# EAGLE design LiDAR_Lite_Interface_HardSwitch (EAGLE 9.2.1)
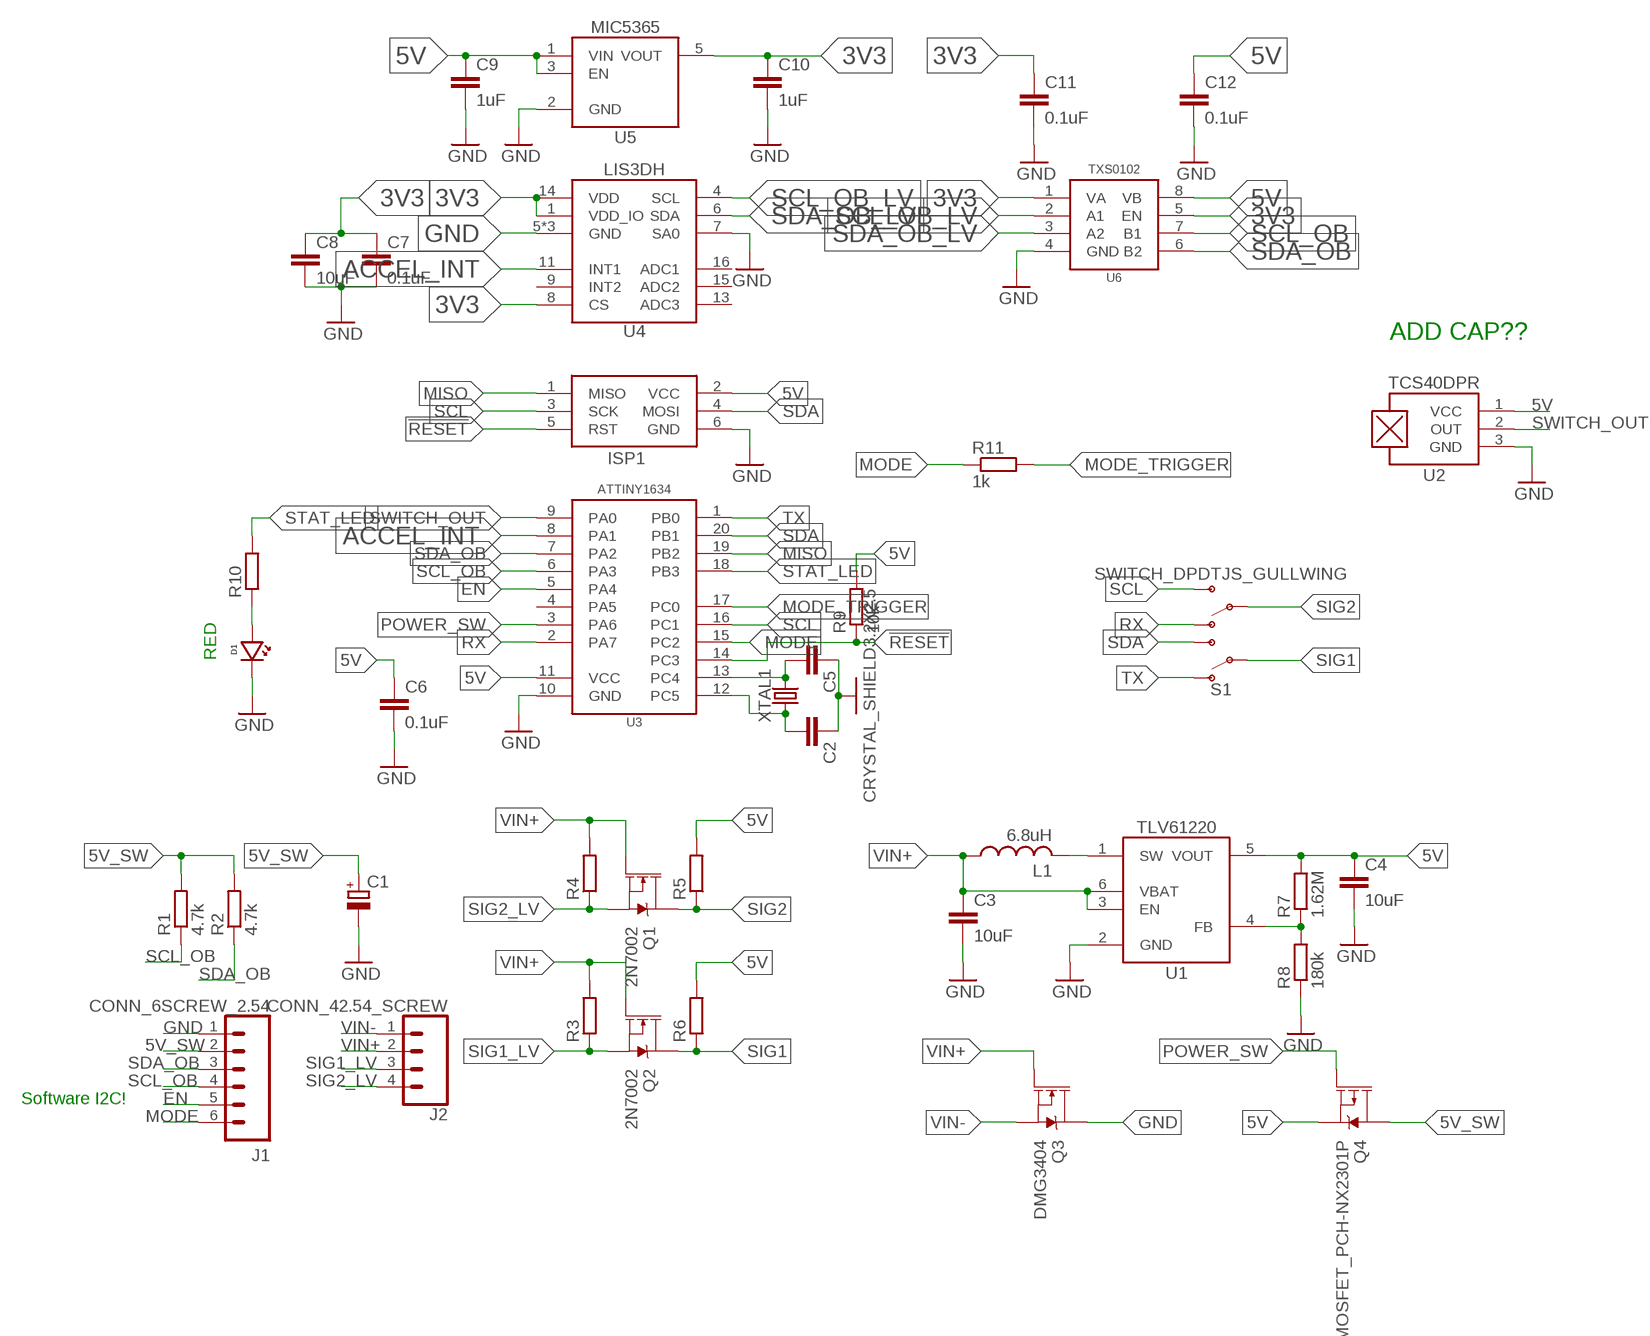
[diagram p0: schematic, sheet 1]

## Parts
C1  CPOL-EUUW-10X10  [UW-10X10_NICHICON]
C2  C-EU10PFC0603  [C0603]
C3  10uF  C-EU10UFC0805  [C0805]
C4  10uF  C-EU10UFC0805  [C0805]
C5  C-EU10PFC0603  [C0603]
C6  0.1uF  C-EU0.1UFC0603  [C0603]
C7  0.1uF  C-EU10UFC0805  [C0805]
C8  10uF  C-EU0.1UFC0603  [C0603]
C9  1uF  C-EU1UFC0603  [C0603]
C10  1uF  C-EU1UFC0603  [C0603]
C11  0.1uF  C-EU0.1UFC0402  [C0402]
C12  0.1uF  C-EU0.1UFC0402  [C0402]
D1  LED0603  [LED_0603]
ISP1  AVRISP-6  [AVRISP]
J1  CONN_6SCREW_2.54  [1X06_SCREW]
J2  CONN_42.54_SCREW  [1X04_SCREW]
L1  6.8uH  INDUCTOR1008  [1008]
Q1  2N7002  MOSFET-NCH-2N7002P  [SOT23-3]
Q2  2N7002  MOSFET-NCH-2N7002P  [SOT23-3]
Q3  DMG3404  MOSFET-NCH-DMG3404L  [SOT23-3]
Q4  MOSFET_PCH-NX2301P  [SOT23-3]
R1  4.7k  R-EU_4.7KR0603  [R0603]
R2  4.7k  R-EU_4.7KR0603  [R0603]
R3  R-EU_10KR0603  [R0603]
R4  R-EU_10KR0603  [R0603]
R5  R-EU_10KR0603  [R0603]
R6  R-EU_10KR0603  [R0603]
R7  1.62M  R-EU_1.62MR0603  [R0603]
R8  180k  R-EU_180KR0603  [R0603]
R9  10k  R-EU_10KR0603  [R0603]
R10  R-EU_330R0603  [R0603]
R11  1k  R-EU_1KR0603  [R0603]
S1  SWITCH_DPDTJS_GULLWING  [JS202011SCQN]
U1  TLV61220DBV  [DBV_R-PDSO-G6]
U2  TCS40DPRSOT23  [SOT23-3]
U3  ATTINY1634SOIC  [SO-20DW]
U4  LIS3DHLGA  [LGA-16]
U5  MIC53653.3SC70  [DCK_R-PDSO-G5]
U6  TXS0102DQM  [DQM_R-PX2SON-N8]
XTAL1  CRYSTAL_SHIELD3.2X2.5  [CRYSTAL_3.2X2.5_4-SMD]

## Nets
3V3: C7.1 C8.1 C10.1 C11.1 U4.1(VDD_IO) U4.8(CS) U4.14(VDD) U5.5(VOUT) U6.1(VA) U6.5(EN)
5V: C4.1 C6.1 C9.1 C12.1 ISP1.2(VCC) Q4.2(S) R5.2 R6.2 R7.2 R9.2 U1.5(VOUT) U2.1(VCC) U3.11(VCC) U5.1(VIN) U5.3(EN) U6.8(VB)
5V_SW: C1.+ J1.2 Q4.3(D) R1.2 R2.2
!RESET: ISP1.5(RST) R9.1 U3.14(PC3)
ACCEL_INT: U3.8(PA1) U4.11(INT1)
EN: J1.5 U3.5(PA4)
GND: C1.- C2.1 C3.2 C4.2 C5.1 C6.2 C7.2 C8.2 C9.2 C10.2 C11.2 C12.2 D1.CATHODE ISP1.6(GND) J1.1 Q3.3(D) R8.1 U1.2(GND) U2.3(GND) U3.10(GND) U4.5(GND) U4.7(SA0) U4.10(GND) U4.12(GND) U5.2(GND) U6.4(GND) XTAL1.2(GND) XTAL1.4(GND)
MISO: ISP1.1(MISO) U3.19(PB2)
MODE: J1.6 R11.1 U3.15(PC2)
MODE_TRIGGER: R11.2 U3.17(PC0)
N$1: C5.2 U3.13(PC4) XTAL1.3
N$3: C2.2 U3.12(PC5) XTAL1.1
N$4: D1.ANODE R10.1
N$7: R7.1 R8.2 U1.4(FB)
N$9: L1.2 U1.1(SW)
POWER_SW: Q4.1(G) U3.3(PA6)
RX: S1.6(O2) U3.2(PA7)
SCL: ISP1.3(SCK) S1.4(S2) U3.16(PC1)
SCL_OB: J1.4 R1.1 U3.6(PA3) U6.7(B1)
SCL_OB_LV: U4.4(SCL) U6.2(A1)
SDA: ISP1.4(MOSI) S1.3(S1) U3.20(PB1)
SDA_OB: J1.3 R2.1 U3.7(PA2) U6.6(B2)
SDA_OB_LV: U4.6(SDA) U6.3(A2)
SIG1: Q2.3(D) R6.1 S1.2(P1)
SIG1_LV: J2.3 Q2.2(S) R3.1
SIG2: Q1.3(D) R5.1 S1.5(P2)
SIG2_LV: J2.4 Q1.2(S) R4.1
STAT_LED: R10.2 U3.18(PB3)
SWITCH_OUT: U2.2(OUT) U3.9(PA0)
TX: S1.1(O1) U3.1(PB0)
VIN+: C3.1 J2.2 L1.1 Q1.1(G) Q2.1(G) Q3.1(G) R3.2 R4.2 U1.3(EN) U1.6(VBAT)
VIN-: J2.1 Q3.2(S)
Unconnected: U3.4(PA5) U4.9(INT2) U4.13(ADC3) U4.15(ADC2) U4.16(ADC1)

## Notes on the sheet
- ADD CAP??
- RED
- Software I2C!

## Library data of the parts
C1 = bschulz_passives:CPOL-EU: POLARIZED CAPACITOR, European symbol; DIGIKEY: 493-2182-1-ND; MF: Nichicon; MPN: UWT1C681MNL1GS
C2 C5 = bschulz_passives:C-EU: CAPACITOR, European symbol; DIGIKEY: 311-1058-1-ND; MF: Yageo; MPN: CC0603JRNPO9BN100CC0603JRNPO9BN100
C3 C4 C7 = bschulz_passives:C-EU: CAPACITOR, European symbol; DIGIKEY: 490-6473-6-ND; MF: Murata; MPN: GRM21BR61C106KE15K
C6 C8 = bschulz_passives:C-EU: CAPACITOR, European symbol; DIGIKEY: 490-6051-1-ND; MF: Murata; MPN: GCM188R71E104KA57D
C9 C10 = bschulz_passives:C-EU: CAPACITOR, European symbol; DIGIKEY: 490-10479-1-ND; MF: Murata; MPN: GRM188R61C105KA12D
C11 C12 = bschulz_passives:C-EU: CAPACITOR, European symbol; DIGIKEY: 490-4759-1-ND; MF: Murata; MPN: GCM155R71C104KA55D
D1 = bschulz:LED: Genaric LED; DIGIKEY: 732-4978-1-ND; MF: Wurth; MPN: 150060RS75000
ISP1 = bschulz:AVRISP: AVR ISP HEADER Standard 6 pin header for AVR programming
J1 = bschulz:CONN_6: Genaric 6 terminal header Digikey 2.54_SCREW <https://www.digikey.com/product-detail/en/on-shore-technology-inc/OSTVN06A150/ED10565-ND/1588866>; DIGIKEY: ED10565-ND; MF: OnShore; MPN: OSTVN06A150
J2 = bschulz:CONN_4: Genaric 4 terminal header Digikey 2.54_SCREW <https://www.digikey.com/product-detail/en/on-shore-technology-inc/OSTVN04A150/ED10563-ND/1588864>; DIGIKEY: ED10563-ND; MF: On Shore; MPN: OSTVN04A150
L1 = bschulz:INDUCTOR: Genaric inductor; DIGIKEY: 732-4849-1-ND; MF: Wurth; MPN: 74438323068
Q1 Q2 = bschulz:MOSFET-NCH: N-channel MOSFETs Voltage controlled devices that allow control of high current outputs. SparkFun Products: SparkFun OpenScale <https://www.sparkfun.com/products/13261> SparkFun Digital Sandbox <https://www.sparkfun.com/products/12651> SparkFun Monster Moto Shield <https://www.sparkfun.com/products/10182> SparkFun MOSFET Power Controller <https://www.sparkfun.com/products/11214>; DIGIKEY: 1727-4692-1-ND; MF: Nexperia; MPN: 2N7002P,215
Q3 = bschulz:MOSFET-NCH: N-channel MOSFETs Voltage controlled devices that allow control of high current outputs. SparkFun Products: SparkFun OpenScale <https://www.sparkfun.com/products/13261> SparkFun Digital Sandbox <https://www.sparkfun.com/products/12651> SparkFun Monster Moto Shield <https://www.sparkfun.com/products/10182> SparkFun MOSFET Power Controller <https://www.sparkfun.com/products/11214>; DIGIKEY: DMG3404L-7DICT-ND; MF: Diodes Incorporated; MPN: DMG3404L-7
Q4 = bschulz:MOSFET_PCH: P-channel MOSFETs Voltage controlled devices that allow control of high current outputs. SparkFun Products: SparkFun ESP32 Thing <https://www.sparkfun.com/products/13907> SparkFun ESP8266 Thing <https://www.sparkfun.com/products/13231>; DIGIKEY: 1727-1148-1-ND; MF: Nexperia; MPN: NX2301P,215
R1 R2 = bschulz_passives:R-EU_: RESISTOR, European symbol Digikey Parts: Yageo, 0402 <https://www.digikey.com/products/en/resistors/chip-resistor-surface-mount/52?k=&pkeyword=&sf=0&FV=ffec1104%2Cfffc000d%2C1c0002%2C440067%2C1f140000%2Cffe00034%2C400004&quantity=&ColumnSort=0&page=1&stock=1&pageSize=25> Yageo, 0603 <https://www.digikey.com/products/en/resistors/chip-resistor-surface-mount/52?k=&pkeyword=&s=4356&s=47360&sf=0&FV=fffc000d%2C1c0002%2C142c040c%2C1f140000%2Cffe00034&quantity=10&ColumnSort=1000011&page=1&stock=1&pageSize=25> Panasonic, 0603 <https://www.digikey.com/products/en/resistors/chip-resistor-surface-mount/52?k=&pkeyword=&pv252=68&sf=0&FV=ffec373d%2C1c0002%2C142c040c%2C1f140000%2Cffe00034%2C80002%2Cc0001&quantity=&ColumnSort=0&page=1&stock=1&pageSize=25> Panasonic, precision, 0603 <https://www.digikey.com/products/en/resistors/chip-resistor-surface-mount/52?FV=ffec4907%2Cfffc000a%2Cc0172%2C142c040c%2C1f140000%2Cffe00034%2C1c0002&quantity=100&ColumnSort=2085&page=1&stock=1&pageSize=25> Panasonic, 0805 <https://www.digikey.com/products/en/resistors/chip-resistor-surface-mount/52?k=&pkeyword=&pv3=1&sf=0&FV=ffec373d%2C1c0002%2C1f140000%2Cffe00034%2C142c040d&quantity=&ColumnSort=0&page=1&stock=1&pageSize=25> Rohm, current sense <https://www.digikey.com/products/en/resistors/chip-resistor-surface-mount/52?k=&pkeyword=&pv3=1&sf=0&FV=ffecb688%2C1f140000%2Cffe00034%2C1c0002&quantity=&ColumnSort=0&page=1&stock=1&pageSize=25> Vishay, pulse proof automotive <https://www.digikey.com/products/en/resistors/chip-resistor-surface-mount/52?k=&pkeyword=&pv7=2&sf=0&FV=ffec5d6b%2Cffe00034%2C1f140000&quantity=&ColumnSort=0&page=1&stock=1&pageSize=25>; DIGIKEY: 311-4.70KHRCT-ND; MF: Yageo; MPN: RC0603FR-074K7L; VALUE_PART: 4.7k
R3-R6 R9 = bschulz_passives:R-EU_: RESISTOR, European symbol Digikey Parts: Yageo, 0402 <https://www.digikey.com/products/en/resistors/chip-resistor-surface-mount/52?k=&pkeyword=&sf=0&FV=ffec1104%2Cfffc000d%2C1c0002%2C440067%2C1f140000%2Cffe00034%2C400004&quantity=&ColumnSort=0&page=1&stock=1&pageSize=25> Yageo, 0603 <https://www.digikey.com/products/en/resistors/chip-resistor-surface-mount/52?k=&pkeyword=&s=4356&s=47360&sf=0&FV=fffc000d%2C1c0002%2C142c040c%2C1f140000%2Cffe00034&quantity=10&ColumnSort=1000011&page=1&stock=1&pageSize=25> Panasonic, 0603 <https://www.digikey.com/products/en/resistors/chip-resistor-surface-mount/52?k=&pkeyword=&pv252=68&sf=0&FV=ffec373d%2C1c0002%2C142c040c%2C1f140000%2Cffe00034%2C80002%2Cc0001&quantity=&ColumnSort=0&page=1&stock=1&pageSize=25> Panasonic, precision, 0603 <https://www.digikey.com/products/en/resistors/chip-resistor-surface-mount/52?FV=ffec4907%2Cfffc000a%2Cc0172%2C142c040c%2C1f140000%2Cffe00034%2C1c0002&quantity=100&ColumnSort=2085&page=1&stock=1&pageSize=25> Panasonic, 0805 <https://www.digikey.com/products/en/resistors/chip-resistor-surface-mount/52?k=&pkeyword=&pv3=1&sf=0&FV=ffec373d%2C1c0002%2C1f140000%2Cffe00034%2C142c040d&quantity=&ColumnSort=0&page=1&stock=1&pageSize=25> Rohm, current sense <https://www.digikey.com/products/en/resistors/chip-resistor-surface-mount/52?k=&pkeyword=&pv3=1&sf=0&FV=ffecb688%2C1f140000%2Cffe00034%2C1c0002&quantity=&ColumnSort=0&page=1&stock=1&pageSize=25> Vishay, pulse proof automotive <https://www.digikey.com/products/en/resistors/chip-resistor-surface-mount/52?k=&pkeyword=&pv7=2&sf=0&FV=ffec5d6b%2Cffe00034%2C1f140000&quantity=&ColumnSort=0&page=1&stock=1&pageSize=25>; DIGIKEY: 311-10.0KHRCT-ND; MF: Yageo; MPN: RC0603FR-0710KL; VALUE_PART: 10k
R7 = bschulz_passives:R-EU_: RESISTOR, European symbol Digikey Parts: Yageo, 0402 <https://www.digikey.com/products/en/resistors/chip-resistor-surface-mount/52?k=&pkeyword=&sf=0&FV=ffec1104%2Cfffc000d%2C1c0002%2C440067%2C1f140000%2Cffe00034%2C400004&quantity=&ColumnSort=0&page=1&stock=1&pageSize=25> Yageo, 0603 <https://www.digikey.com/products/en/resistors/chip-resistor-surface-mount/52?k=&pkeyword=&s=4356&s=47360&sf=0&FV=fffc000d%2C1c0002%2C142c040c%2C1f140000%2Cffe00034&quantity=10&ColumnSort=1000011&page=1&stock=1&pageSize=25> Panasonic, 0603 <https://www.digikey.com/products/en/resistors/chip-resistor-surface-mount/52?k=&pkeyword=&pv252=68&sf=0&FV=ffec373d%2C1c0002%2C142c040c%2C1f140000%2Cffe00034%2C80002%2Cc0001&quantity=&ColumnSort=0&page=1&stock=1&pageSize=25> Panasonic, precision, 0603 <https://www.digikey.com/products/en/resistors/chip-resistor-surface-mount/52?FV=ffec4907%2Cfffc000a%2Cc0172%2C142c040c%2C1f140000%2Cffe00034%2C1c0002&quantity=100&ColumnSort=2085&page=1&stock=1&pageSize=25> Panasonic, 0805 <https://www.digikey.com/products/en/resistors/chip-resistor-surface-mount/52?k=&pkeyword=&pv3=1&sf=0&FV=ffec373d%2C1c0002%2C1f140000%2Cffe00034%2C142c040d&quantity=&ColumnSort=0&page=1&stock=1&pageSize=25> Rohm, current sense <https://www.digikey.com/products/en/resistors/chip-resistor-surface-mount/52?k=&pkeyword=&pv3=1&sf=0&FV=ffecb688%2C1f140000%2Cffe00034%2C1c0002&quantity=&ColumnSort=0&page=1&stock=1&pageSize=25> Vishay, pulse proof automotive <https://www.digikey.com/products/en/resistors/chip-resistor-surface-mount/52?k=&pkeyword=&pv7=2&sf=0&FV=ffec5d6b%2Cffe00034%2C1f140000&quantity=&ColumnSort=0&page=1&stock=1&pageSize=25>; DIGIKEY: RMCF0603FT1M62CT-ND; MF: Stackpole; MPN: RMCF0603FT1M62; VALUE_PART: 1.62M
R8 = bschulz_passives:R-EU_: RESISTOR, European symbol Digikey Parts: Yageo, 0402 <https://www.digikey.com/products/en/resistors/chip-resistor-surface-mount/52?k=&pkeyword=&sf=0&FV=ffec1104%2Cfffc000d%2C1c0002%2C440067%2C1f140000%2Cffe00034%2C400004&quantity=&ColumnSort=0&page=1&stock=1&pageSize=25> Yageo, 0603 <https://www.digikey.com/products/en/resistors/chip-resistor-surface-mount/52?k=&pkeyword=&s=4356&s=47360&sf=0&FV=fffc000d%2C1c0002%2C142c040c%2C1f140000%2Cffe00034&quantity=10&ColumnSort=1000011&page=1&stock=1&pageSize=25> Panasonic, 0603 <https://www.digikey.com/products/en/resistors/chip-resistor-surface-mount/52?k=&pkeyword=&pv252=68&sf=0&FV=ffec373d%2C1c0002%2C142c040c%2C1f140000%2Cffe00034%2C80002%2Cc0001&quantity=&ColumnSort=0&page=1&stock=1&pageSize=25> Panasonic, precision, 0603 <https://www.digikey.com/products/en/resistors/chip-resistor-surface-mount/52?FV=ffec4907%2Cfffc000a%2Cc0172%2C142c040c%2C1f140000%2Cffe00034%2C1c0002&quantity=100&ColumnSort=2085&page=1&stock=1&pageSize=25> Panasonic, 0805 <https://www.digikey.com/products/en/resistors/chip-resistor-surface-mount/52?k=&pkeyword=&pv3=1&sf=0&FV=ffec373d%2C1c0002%2C1f140000%2Cffe00034%2C142c040d&quantity=&ColumnSort=0&page=1&stock=1&pageSize=25> Rohm, current sense <https://www.digikey.com/products/en/resistors/chip-resistor-surface-mount/52?k=&pkeyword=&pv3=1&sf=0&FV=ffecb688%2C1f140000%2Cffe00034%2C1c0002&quantity=&ColumnSort=0&page=1&stock=1&pageSize=25> Vishay, pulse proof automotive <https://www.digikey.com/products/en/resistors/chip-resistor-surface-mount/52?k=&pkeyword=&pv7=2&sf=0&FV=ffec5d6b%2Cffe00034%2C1f140000&quantity=&ColumnSort=0&page=1&stock=1&pageSize=25>; DIGIKEY: P180KHCT-ND; MF: Panasonic; MPN: ERJ-3EKF1803V; VALUE_PART: 180k
R10 = bschulz_passives:R-EU_: RESISTOR, European symbol Digikey Parts: Yageo, 0402 <https://www.digikey.com/products/en/resistors/chip-resistor-surface-mount/52?k=&pkeyword=&sf=0&FV=ffec1104%2Cfffc000d%2C1c0002%2C440067%2C1f140000%2Cffe00034%2C400004&quantity=&ColumnSort=0&page=1&stock=1&pageSize=25> Yageo, 0603 <https://www.digikey.com/products/en/resistors/chip-resistor-surface-mount/52?k=&pkeyword=&s=4356&s=47360&sf=0&FV=fffc000d%2C1c0002%2C142c040c%2C1f140000%2Cffe00034&quantity=10&ColumnSort=1000011&page=1&stock=1&pageSize=25> Panasonic, 0603 <https://www.digikey.com/products/en/resistors/chip-resistor-surface-mount/52?k=&pkeyword=&pv252=68&sf=0&FV=ffec373d%2C1c0002%2C142c040c%2C1f140000%2Cffe00034%2C80002%2Cc0001&quantity=&ColumnSort=0&page=1&stock=1&pageSize=25> Panasonic, precision, 0603 <https://www.digikey.com/products/en/resistors/chip-resistor-surface-mount/52?FV=ffec4907%2Cfffc000a%2Cc0172%2C142c040c%2C1f140000%2Cffe00034%2C1c0002&quantity=100&ColumnSort=2085&page=1&stock=1&pageSize=25> Panasonic, 0805 <https://www.digikey.com/products/en/resistors/chip-resistor-surface-mount/52?k=&pkeyword=&pv3=1&sf=0&FV=ffec373d%2C1c0002%2C1f140000%2Cffe00034%2C142c040d&quantity=&ColumnSort=0&page=1&stock=1&pageSize=25> Rohm, current sense <https://www.digikey.com/products/en/resistors/chip-resistor-surface-mount/52?k=&pkeyword=&pv3=1&sf=0&FV=ffecb688%2C1f140000%2Cffe00034%2C1c0002&quantity=&ColumnSort=0&page=1&stock=1&pageSize=25> Vishay, pulse proof automotive <https://www.digikey.com/products/en/resistors/chip-resistor-surface-mount/52?k=&pkeyword=&pv7=2&sf=0&FV=ffec5d6b%2Cffe00034%2C1f140000&quantity=&ColumnSort=0&page=1&stock=1&pageSize=25>; DIGIKEY: 311-330HRCT-ND; MF: Yageo; MPN: RC0603FR-07330RL; VALUE_PART: 330
R11 = bschulz_passives:R-EU_: RESISTOR, European symbol Digikey Parts: Yageo, 0402 <https://www.digikey.com/products/en/resistors/chip-resistor-surface-mount/52?k=&pkeyword=&sf=0&FV=ffec1104%2Cfffc000d%2C1c0002%2C440067%2C1f140000%2Cffe00034%2C400004&quantity=&ColumnSort=0&page=1&stock=1&pageSize=25> Yageo, 0603 <https://www.digikey.com/products/en/resistors/chip-resistor-surface-mount/52?k=&pkeyword=&s=4356&s=47360&sf=0&FV=fffc000d%2C1c0002%2C142c040c%2C1f140000%2Cffe00034&quantity=10&ColumnSort=1000011&page=1&stock=1&pageSize=25> Panasonic, 0603 <https://www.digikey.com/products/en/resistors/chip-resistor-surface-mount/52?k=&pkeyword=&pv252=68&sf=0&FV=ffec373d%2C1c0002%2C142c040c%2C1f140000%2Cffe00034%2C80002%2Cc0001&quantity=&ColumnSort=0&page=1&stock=1&pageSize=25> Panasonic, precision, 0603 <https://www.digikey.com/products/en/resistors/chip-resistor-surface-mount/52?FV=ffec4907%2Cfffc000a%2Cc0172%2C142c040c%2C1f140000%2Cffe00034%2C1c0002&quantity=100&ColumnSort=2085&page=1&stock=1&pageSize=25> Panasonic, 0805 <https://www.digikey.com/products/en/resistors/chip-resistor-surface-mount/52?k=&pkeyword=&pv3=1&sf=0&FV=ffec373d%2C1c0002%2C1f140000%2Cffe00034%2C142c040d&quantity=&ColumnSort=0&page=1&stock=1&pageSize=25> Rohm, current sense <https://www.digikey.com/products/en/resistors/chip-resistor-surface-mount/52?k=&pkeyword=&pv3=1&sf=0&FV=ffecb688%2C1f140000%2Cffe00034%2C1c0002&quantity=&ColumnSort=0&page=1&stock=1&pageSize=25> Vishay, pulse proof automotive <https://www.digikey.com/products/en/resistors/chip-resistor-surface-mount/52?k=&pkeyword=&pv7=2&sf=0&FV=ffec5d6b%2Cffe00034%2C1f140000&quantity=&ColumnSort=0&page=1&stock=1&pageSize=25>; DIGIKEY: 311-1KLDCT-ND; MF: Yageo; MPN: AC0603FR-071KL; VALUE_PART: 1k
S1 = bschulz:SWITCH_DPDT: Genric DPDT Switch; DIGIKEY: 401-2002-1-ND; MF: C&K; MPN: JS202011SCQN
U1 = bschulz:TLV61220: TLV61220 - Low-Input Voltage Step-Up Converter (Boost) Characteristics: Vin: 0.7V ~ 5.5V Vout: 1.8V ~ 5.5V Output Current (Max): 400 mA IQ: 5μA Operating Temperature: -40°C to 85°C Digikey: 296-30547-1-ND <https://www.digikey.com/product-detail/en/texas-instruments/TLV61220DBVR/296-30547-1-ND/3458120>; DIGIKEY: 296-30547-1-ND; MF: TI; MPN: TLV61220DBVR
U2 = bschulz:TCS40DPR: Hall Effect Sensor (TCS40DPR) Characteristics: Vcc: 2.3 ~ 5.5V ISupply: 12.8μA (Avg) IDrive: 1mA (10mA Max) Trip Point: 4.4mT (Max) Release Point: 0.4mT (Min) Hysterisis: 1.4mT Temp: -40°C ~ 85°C Digikey: TCS40DPRLFCT-ND <https://www.digikey.com/product-detail/en/toshiba-semiconductor-and-storage/TCS40DPRLF/TCS40DPRLFCT-ND/5012766>; DIGIKEY: TCS40DPRLFCT-ND; DISP: TCS40DPR; MF: Toshiba; MPN: TCS40DPR,LF
U3 = bschulz:ATTINY1634: ATtiny1634 8 bit AVR Microcontroller Features: Vcc: 1.8 ~ 5.5V Clock: Up to 16MHz, Internal 8MHz FRC, 32kHz RC Flash Memory: 16K SRAM: 1K EEPROM: 256B ADC: 10b, 12 port USART: Yes, x2 SPI: Yes I2C: Yes, slave only Notes: 2 analog comp. Digikey: ATTINY1634R-MURCT-ND (QFN) <https://www.digikey.com/product-detail/en/microchip-technology/ATTINY1634R-MUR/ATTINY1634R-MURCT-ND/3440781> ATTINY1634R-SU-ND (SOIC) <https://www.digikey.com/product-detail/en/ATTINY1634R-SU/ATTINY1634R-SU-ND/3128699/?itemSeq=272981030>; DIGIKEY: ATTINY1634-SURCT-ND; MF: Atmel; MPN: ATTINY1634-SUR
U4 = bschulz:LIS3DH: LIS3DH - Ultra-low-power High-performance 3-axis Digital Accelerometer (I2C/SPI) Characteristics: Vcc: 1.71V ~ 3.6V Acceleration Range: ±2g, ±4g, ±8g, ±16g Sensitivity: 1000 ~ 83 LSB/g (±2g ~ ± 16g) Bandwidth: 0.5Hz ~ 625kHz Operating Temperature: -40°C to 85°C Digikey: 497-10613-1-ND <https://www.digikey.com/product-detail/en/stmicroelectronics/LIS3DHTR/497-10613-1-ND/2334355>; DIGIKEY: 497-10613-1-ND; MF: ST; MPN: LIS3DHTR
U5 = bschulz:MIC5365: MIC5365-* - Low Power, High Performance, Linear Regulator Characteristics: Vin: 2.5V ~ 5.5V Vout: Many options, (1v ~ 3.3v) see datasheet <http://ww1.microchip.com/downloads/en/DeviceDoc/mic5365.pdf> IQ: 29μA typ Dropout Voltage: 55mV @ 50mA, input ≥ 2.8v Voltage Accuracy: 2% typ Output Current: 150 mA Operating Temperature: -40°C to 125°C Mouser: MIC5365-3.3YC5 (3.3V Fixed) <https://www.digikey.com/product-detail/en/microchip-technology/MIC5365-3.3YC5-TR/576-3193-1-ND/1868230> MIC5365-1.8YC5 (1.8V Fixed) <https://www.digikey.com/products/en/integrated-circuits-ics/pmic-voltage-regulators-linear/699?k=mic5365&k=&pkeyword=mic5365&sv=0&pv1291=881&sf=0&FV=1c0002%2C1f140000%2Cffe002bb%2C1bcc0020&quantity=&ColumnSort=0&page=1&stock=1&pageSize=25>; DIGIKEY: 576-3193-1-ND; MF: Microchip; MPN: MIC5365-3.3YC5-TR
U6 = bschulz:TXS0102: TXS0102 - 2 Channel Bidirectional Voltage Level Translator Characteristics: Vcc: 1.65 ~ 3.6V (Port A), 2.3 ~ 5.5V (Port B) IQ: 14.4μA Output Current: 50mA Output Type: Open Drain/Push-Pull Operating Temperature: -40°C to 85°C Digikey: 296-28368-1-ND (DQE) <https://www.digikey.com/product-detail/en/texas-instruments/TXS0102DQER/296-28368-1-ND/2625893> 296-28435-1-ND (DQM) <https://www.digikey.com/product-detail/en/texas-instruments/TXS0102DQMR/296-28435-1-ND/2638910> 296-21931-1-ND (DCU) <https://www.digikey.com/product-detail/en/texas-instruments/TXS0102DCUR/296-21931-1-ND/1629284>; DIGIKEY: 296-28435-1-ND; MF: TI; MPN: TXS0102DQMR
XTAL1 = bschulz:CRYSTAL_SHIELD: Crystal Oscilator w/Shield 4 Pin quartz crystal oscilators Variants 3.2x2.5mm (16MHz ~ 38.4 MHz) <https://www.digikey.com/products/en/crystals-oscillators-resonators/crystals/171?k=&pkeyword=&sv=0&pv7=2&sf=0&FV=ffe000ab%2Cffec1fd3&quantity=&ColumnSort=0&page=1&stock=1&pageSize=25>; DIGIKEY: 535-10901-1-ND; MF: Abricon; MPN: ABM8G-12.000MHZ-4Y-T3

## Board
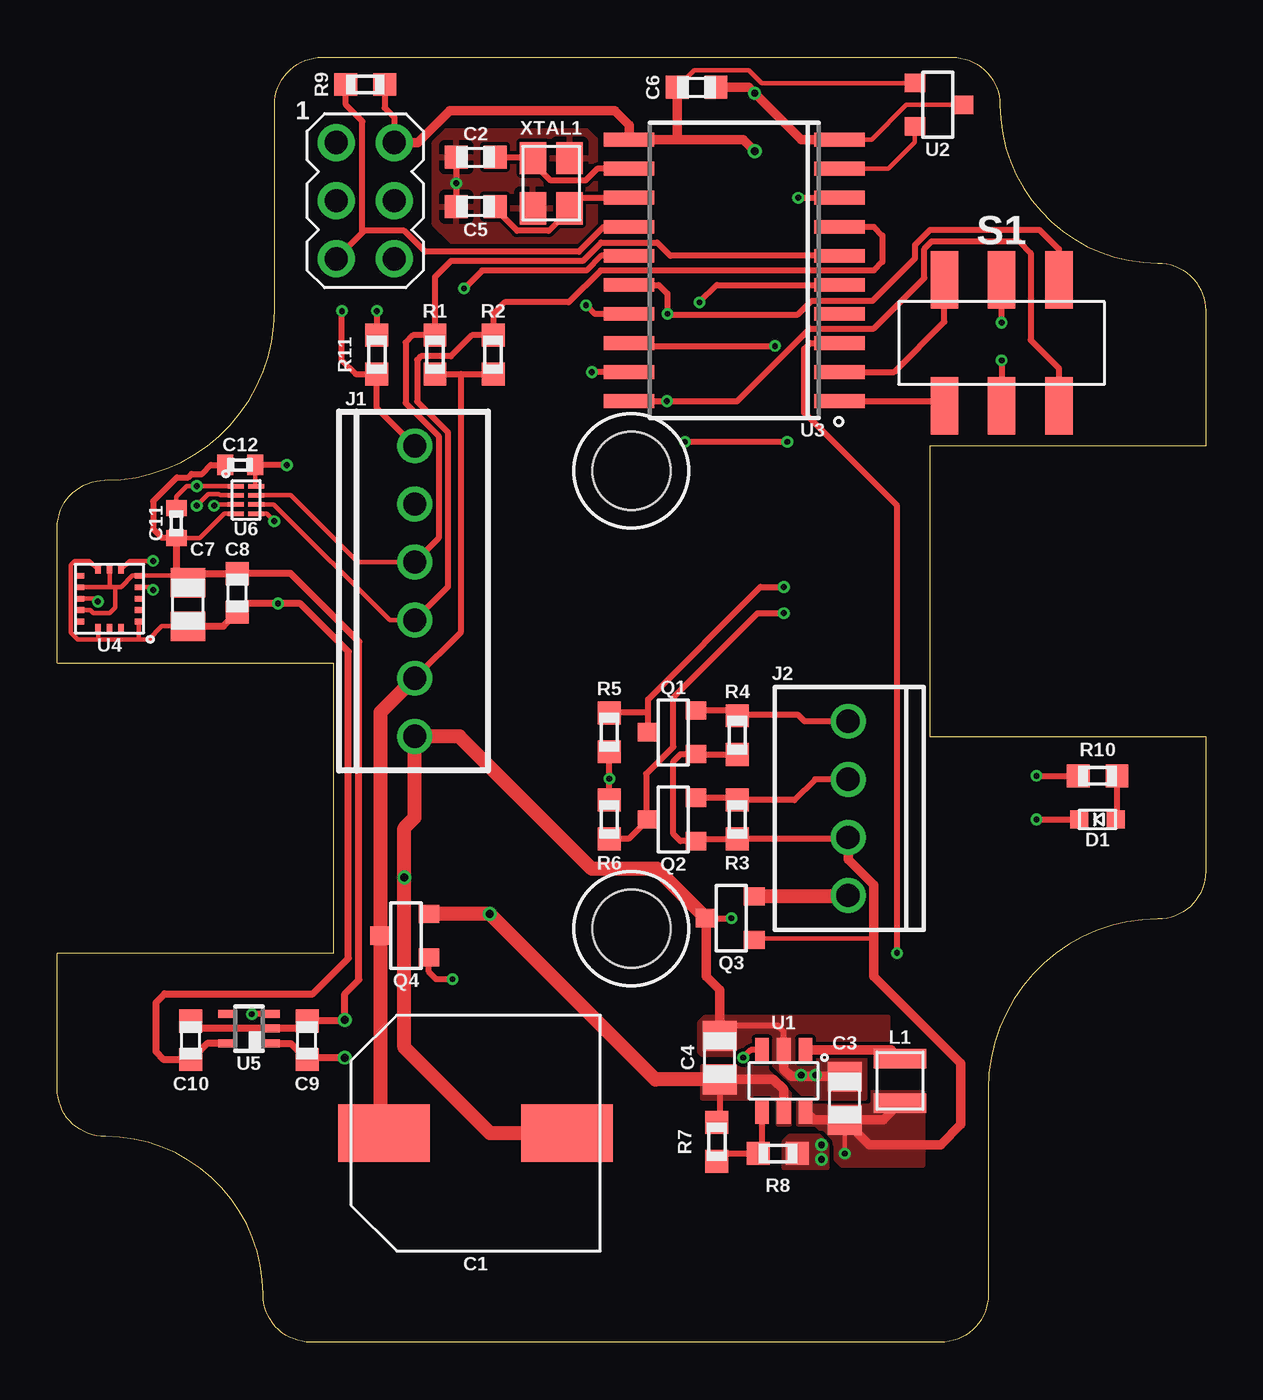
[diagram p1: board, top side]
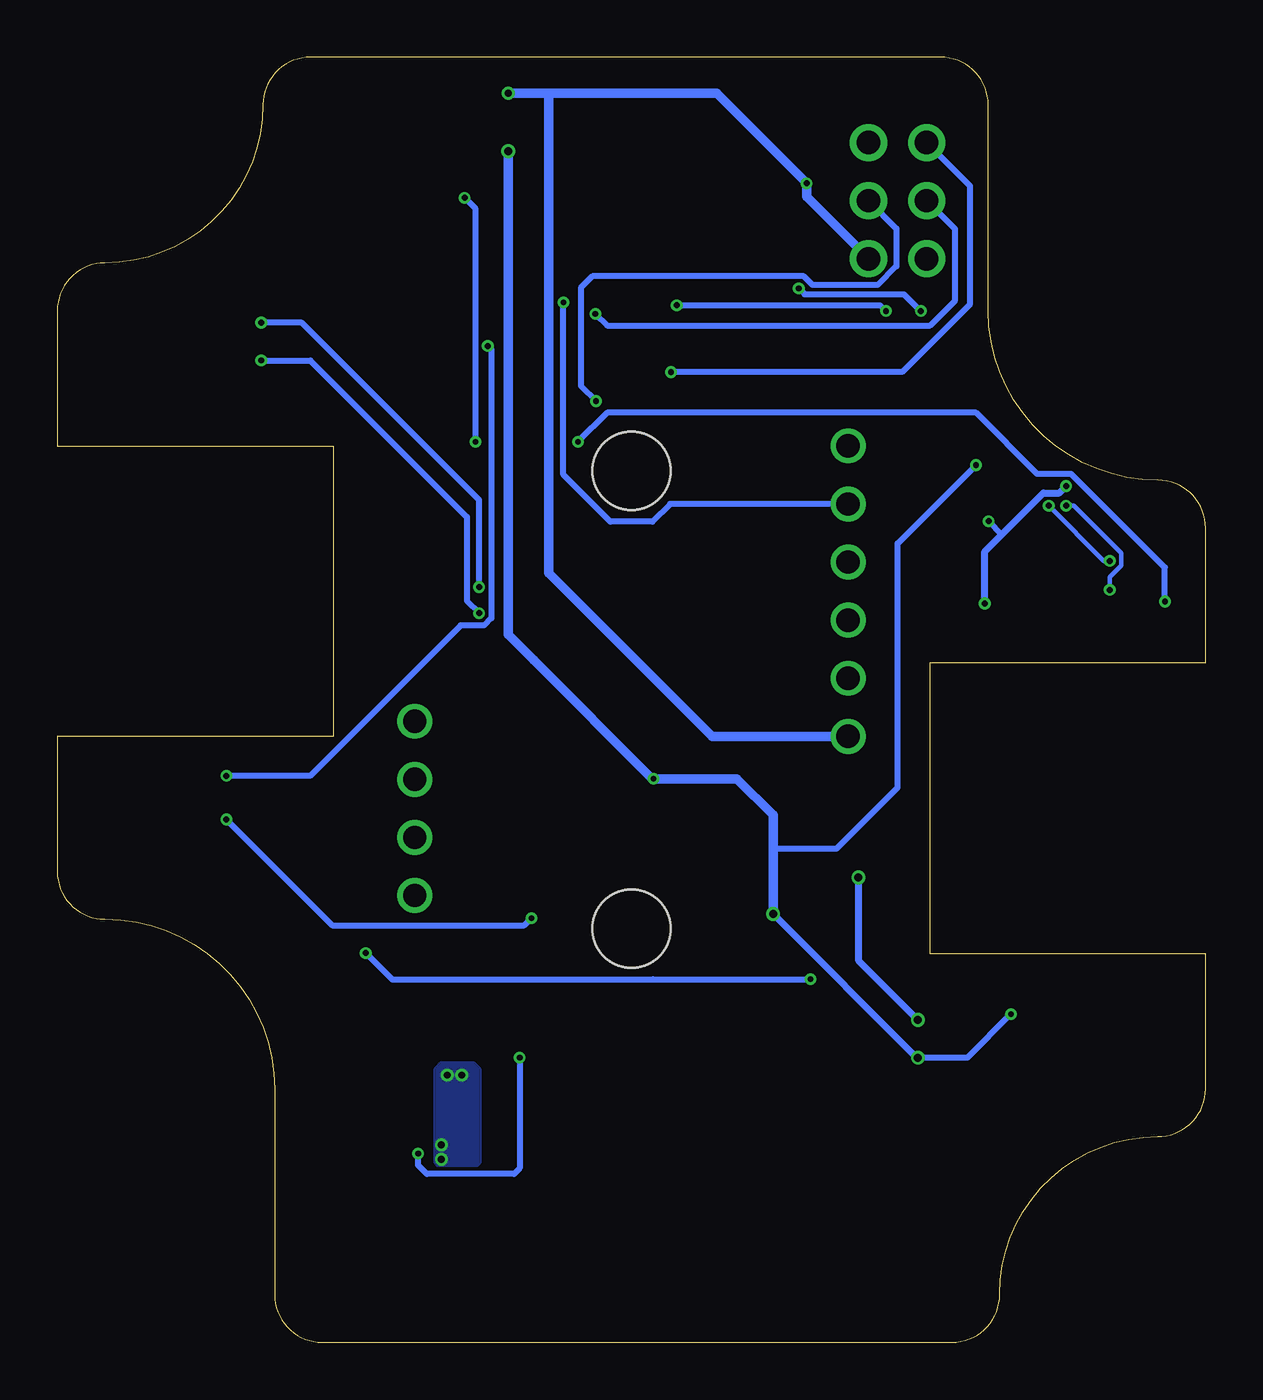
[diagram p2: board, bottom side, seen from below]

Size 50.19 x 56.18 mm. Coordinates in mm from the lower left corner, seen from the top.
Outline: 38.61,0 11.08,0 arc-90 9,2.1 arc90 2.1,9 arc-90 0,11.08 0,16.99 12.06,16.99 12.06,29.69 0,29.69 0,35.61 arc-90 2.08,37.69 arc90 9.5,45.11 9.5,54.1 arc-90 11.58,56.19 39.12,56.19 arc-90 41.2,54.1 arc90 48.11,47.19 arc-90 50.19,45.1 50.19,39.19 38.12,39.19 38.12,26.49 50.19,26.49 50.19,20.58 arc-90 48.11,18.5 arc90 40.69,11.08 40.69,2.08 arc-90 38.61,0
Copper layers (1*16): Top 0.035559375mm / dielectric 1.6mm / Bottom 0.035559375mm
Design rules "oshpark-2layer": minimum track width 6mil, minimum drill 10mil, track to track 6mil, track to pad 6mil, pad to pad 6mil, via to via 6mil, smd to smd 6mil, copper to edge 15mil, drill to drill 6mil, minimum pad ring 5mil, minimum via ring 5mil, stop-mask expansion 2.5mil, vias tented up to drill 0mil, thermal gap 10mil
Holes 3.43 mm at 25.1,18.08 25.1,38.1

### Footprints (pad centres in the part's own frame; a part is rotated, then mirrored left to right if it is on the bottom)
UW-10X10_NICHICON = smd 2.5 x 4: + 0,4; - 0,-4
C0603 = smd 1 x 1: 1 -0.85,0; 2 0.85,0
C0805 = smd 1.3 x 1.5: 1 -0.95,0; 2 0.95,0
C0402 = smd 0.7 x 0.9: 1 -0.65,0; 2 0.65,0
LED_0603 = smd 0.8 x 0.8: ANODE 0.8,0; CATHODE -0.8,0
AVRISP = drill 1.02 pad 1.626: 1 -1.27,2.54; 2 1.27,2.54; 3 -1.27,0; 4 1.27,0; 5 -1.27,-2.54; 6 1.27,-2.54
1X06_SCREW = drill 1.016: 1 -6.35,0; 2 -3.81,0; 3 -1.27,0; 4 1.27,0; 5 3.81,0; 6 6.35,0
1X04_SCREW = drill 1.016: 1 -3.81,0; 2 -1.27,0; 3 1.27,0; 4 3.81,0
1008 = smd 0.85 x 2.3: 1 -0.975,0; 2 0.975,0
SOT23-3 = smd 0.8 x 0.9: 1 -0.95,-1; 2 0.95,-1; 3 0,1.1
R0603 = smd 1 x 1: 1 -0.85,0; 2 0.85,0
JS202011SCQN = smd 1.2 x 2.515: 1 -2.5,-2.75; 2 0,-2.75; 3 2.5,-2.75; 4 2.5,2.75; 5 0,2.75; 6 -2.5,2.75
DBV_R-PDSO-G6 = smd 0.6 x 1.05: 1 -0.95,-1.35; 2 0,-1.35; 3 0.95,-1.35; 4 0.95,1.35; 5 0,1.35; 6 -0.95,1.35
SO-20DW = smd 0.6 x 2.2: 1 -5.715,-4.6; 2 -4.445,-4.6; 3 -3.175,-4.6; 4 -1.905,-4.6; 5 -0.635,-4.6; 6 0.635,-4.6; 7 1.905,-4.6; 8 3.175,-4.6; 9 4.445,-4.6; 10 5.715,-4.6; 11 5.715,4.6; 12 4.445,4.6; 13 3.175,4.6; 14 1.905,4.6; 15 0.635,4.6; 16 -0.635,4.6; 17 -1.905,4.6; 18 -3.175,4.6; 19 -4.445,4.6; 20 -5.715,4.6
LGA-16 = smd 0.35 x 0.25: 1 -1.275,1; 2 -1.275,0.5; 3 -1.275,0; 4 -1.275,-0.5; 5 -1.275,-1; 9 1.275,-1; 10 1.275,-0.5; 11 1.275,0; 12 1.275,0.5; 13 1.275,1 | smd 0.25 x 0.35: 6 -0.5,-1.275; 7 0,-1.275; 8 0.5,-1.275; 14 0.5,1.275; 15 0,1.275; 16 -0.5,1.275
DCK_R-PDSO-G5 = smd 0.35 x 0.8: 1 -0.65,-0.95; 2 0,-0.95; 3 0.65,-0.95; 4 0.65,0.95; 5 -0.65,0.95
DQM_R-PX2SON-N8 = smd 0.2 x 0.7: 1 -0.6,-0.45; 2 -0.2,-0.45; 3 0.2,-0.45; 4 0.6,-0.45; 5 0.6,0.45; 6 0.2,0.45; 7 -0.2,0.45; 8 -0.6,0.45
CRYSTAL_3.2X2.5_4-SMD = smd 1.4 x 1.15: 1 -1.1,-0.8; 2 1.1,-0.8; 3 1.1,0.8; 4 -1.1,0.8

### Placement (x,y rotation side)
C1  680uF  [UW-10X10_NICHICON]  18.29,9.14 90 top
C2  10pF  [C0603]  18.29,51.82 0 top
C3  34.42,10.67 90 top
C4  28.96,12.45 90 top
C5  10pF  [C0603]  18.29,49.66 0 top
C6  27.94,54.86 0 top
C7  10uF  [C0805]  5.71,32.26 90 top
C8  0.1uF  [C0603]  7.87,32.77 90 top
C9  10.92,13.21 90 top
C10  5.84,13.21 90 top
C11  5.21,35.81 270 top
C12  8,38.35 180 top
D1  45.47,22.86 0 top
ISP1  13.46,49.91 0 top
J1  15.62,32.84 90 top
J2  34.56,23.34 90 top
L1  36.83,11.43 90 top
Q1  26.92,26.67 90 top
Q2  26.92,22.86 90 top
Q3  29.46,18.54 90 top
Q4  15.24,17.78 90 top
R1  16.51,43.18 270 top
R2  19.05,43.18 270 top
R3  10k  [R0603]  29.72,22.86 270 top
R4  10k  [R0603]  29.72,26.54 270 top
R5  10k  [R0603]  24.13,26.67 270 top
R6  10k  [R0603]  24.13,22.86 90 top
R7  28.83,8.76 90 top
R8  31.5,8.26 180 top
R9  13.46,54.99 0 top
R10  330  [R0603]  45.47,24.77 180 top
R11  13.97,43.18 90 top
S1  41.27,43.69 0 top
U1  31.75,11.43 180 top
U2  38.48,54.1 270 top
U3  29.59,46.86 90 top
U4  2.29,32.51 180 top
U5  8.38,13.72 90 top
U6  8.26,36.83 270 top
XTAL1  21.59,50.67 270 top

### Tracks (layer width: path | path; a pad name or v marks a point on that pad's centre or on a via)
3V3  (via drill 0.25)
  Top 0.2: 1.78,30.73 0.89,30.73 0.58,31.04 0.58,33.98 0.76,34.16 1.41,34.16 U4.8 | U4.14 1.79,30.74 1.78,30.73 | 5.51,31.51 C7.1 4.57,31.31 4,30.73 3.56,30.73 | U6.1 7.22,37.43 7.21,37.44 v6.1,37.44 5.67,37.44 5.21,36.97 C11.1 | U6.5 9.15,36.23 v9.48,35.9 | 3.56,30.73 1.78,30.73 | U4.1 3.56,30.74 3.56,30.73
  Top 0.305: U5.5 6.55,13.07 C10.1 4.66,12.36 4.32,12.7 4.32,14.86 4.7,15.24 11.18,15.24 12.72,16.79 12.72,30.2 10.63,32.3 v9.65,32.3 8.26,32.3 C8.1 7.27,31.31 C7.1
  Bottom 0.254: v9.48,35.9 8.9,35.32
  Bottom 0.305: v6.1,37.44 6.4,37.13 7.09,37.13 8.9,35.32 9.65,34.57 v9.65,32.3
5V  (via drill 0.25, 0.35)
  Top 0.2: U2.1 30.79,55.05 30.22,55.62 27.84,55.62 C6.1 | C12.1 8.65,37.48 U6.8
  Top 0.254: C4.1 28.96,9.74 R7.2 | R5.2 v24.13,24.64 R6.2 | R9.2 14.31,53.98 14.73,53.55 ISP1.2 | v10.03,38.35 C12.1 | U5.3 8.52,14.37 v8.51,14.35
  Top 0.305: v12.57,12.45 11.01,12.45 C9.1 10.21,13.07 U5.1
  Top 0.406: C4.1 31.3,11.5 31.75,11.05 U1.5 | v30.48,52.07 29.97,52.58 27.05,52.58 | 27.05,52.58 U3.11 24.99,53.21 24.36,53.85 17.14,53.85 15.75,52.45 ISP1.2 | C6.1 27.09,52.62 27.05,52.58
  Top 0.61: C4.1 26.14,11.5 v18.91,18.73 Q4.2
  Bottom 0.254: 29.34,29.84 29.36,29.82 | 18.91,21.59 16.13,21.59 13.46,24.26 13.46,34.92 v10.03,38.35 | v8.51,14.35 10.41,12.45 v12.57,12.45
  Bottom 0.305: v18.91,18.73 12.62,12.45 v12.57,12.45
  Bottom 0.406: v18.91,18.73 18.91,21.59 18.91,23.05 20.5,24.64 v24.13,24.64 24.18,24.64 29.36,29.82 30.48,30.94 v30.48,52.07
  pour Top (rank 2, no thermals): 32,9.53 32,11.3 31.24,12.06 28.19,12.06 28.19,10.67 31.37,10.67 31.5,10.54 31.5,9.53
5V_SW
  Top 0.254: R1.2 17.65,42.33 | 17.65,42.33 R2.2 | J1.2 17.65,31.06 17.65,42.33
  Top 0.61: C1.+ 14.14,9.29 Q4.3 14.14,27.55 J1.2
!RESET
  Top 0.254: U3.14 23.89,48.77 22.8,47.68 16.08,47.68 15.16,48.59 13.41,48.59 13.34,48.51 | ISP1.5 13.34,48.51 | R9.1 12.61,54.1 13.34,53.38 13.34,48.51
ACCEL_INT  (via drill 0.25)
  Top 0.2: U4.11 1.65,32.51 v1.78,32.38
  Top 0.254: v27.43,39.37 v31.91,39.37 | v32.38,50.04 U3.8
  Bottom 0.254: v1.78,32.38 v1.78,32.39 1.78,33.87 5.88,37.97 7.36,37.97 10.03,40.64 26.16,40.64 v27.43,39.37 | v31.91,39.37 31.91,49.56 v32.38,50.04
EN  (via drill 0.25)
  Top 0.254: v28.07,45.47 28.83,46.23 U3.5
  Bottom 0.254: J1.5 23.4,36.65 24.18,35.88 26.02,35.88 28.07,37.93 v28.07,45.47
GND  (via drill 0.25, 0.3, 0.35)
  Top 0.2: U2.3 37.11,54.1 35.59,52.58 U3.10 | C7.2 5.41,33.51 U4.5 3.29,33.51 2.79,33.02 2.54,33.02 | U4.7 2.29,33.02 | U4.10 2.29,33.02 | 2.54,33.02 2.29,33.02 | 2.54,33.02 2.54,32.13 2.29,31.88 2.28,31.88 1.57,31.88 1.44,32.01 U4.12 | U6.4 7.3,36.23 6.23,35.16 C11.2
  Top 0.254: U1.2 31.75,13.59 31.5,13.84 29.4,13.84 C4.2 | C5.1 v17.44,50.67 C2.1 | C11.2 4.59,35.16 4.19,35.56 4.19,36.77 5.24,37.81 5.72,37.81 5.88,37.97 6.33,37.97 6.72,38.35 C12.2 | Q3.3 v29.46,18.54 | v42.8,22.86 D1.CATHODE
  Top 0.305: C10.2 6.18,13.72 U5.2 10.58,13.72 C9.2 12.53,14.06 v12.57,14.1 12.57,15.24 13.18,15.85 13.18,30.63 10.2,33.62 C8.2 6.12,33.62 C7.2 5.21,33.72 C11.2
  Top 0.406: U1.2 31.75,11.94 32.07,11.62 C3.2 | C4.2 28.96,15.41 28.36,16 Q3.3 | U3.10 32.51,52.58 v30.48,54.61 30.23,54.86 C6.2
  Top 0.61: Q3.3 26.2,20.7 23.37,20.7 17.58,26.49 J1.1 15.62,22.94 15.17,22.48 v15.17,20.32 15.17,12.89 18.92,9.14 C1.-
  Bottom 0.254: v29.46,18.54 29.77,18.24 38.18,18.24 v42.8,22.86
  Bottom 0.305: v15.17,20.32 15.17,16.7 v12.57,14.1
  Bottom 0.406: 28.7,54.61 v30.48,54.61 | J1.1 21.56,26.49 28.7,33.63 28.7,54.61 | ISP1.6 17.44,50.08 v17.44,50.67 21.38,54.61 28.7,54.61
  other vias: 32.51,11.68 33.15,11.68 33.4,8.64 33.4,8
  pour Bottom: 33.66,7.87 33.53,7.75 31.88,7.75 31.75,7.87 31.75,11.94 32,12.19 33.4,12.19 33.66,11.94
  pour Top (no thermals): 32,9.02 31.75,8.76 31.75,7.62 33.66,7.62 33.66,8.64 33.27,9.02
  pour Top (no thermals): 31.24,12.57 28.19,12.57 28.07,12.7 28.07,13.97 28.32,14.22 36.32,14.22 36.32,12.57 35.31,12.57 35.31,10.67 32.77,10.67 31.24,12.19
  pour Top: 16.51,52.45 17.02,52.96 23.11,52.96 23.5,52.58 23.5,48.64 22.99,48.13 17.27,48.13 16.51,48.9
MISO  (via drill 0.25)
  Top 0.254: U3.19 v23.37,42.42
  Bottom 0.254: v23.37,42.42 13.27,42.42 10.29,45.4 10.29,50.55 ISP1.1
MODE  (via drill 0.25)
  Top 0.254: J1.6 13.97,40.85 R11.1 13.04,42.33 12.45,42.93 v12.45,45.09 | U3.15 23.77,47.5 23.14,46.86 18.57,46.86 v17.78,46.08
  Bottom 0.254: v17.78,46.08 17.53,45.82 13.18,45.82 v12.45,45.09
MODE_TRIGGER  (via drill 0.25)
  Top 0.254: U3.17 23.5,44.96 v23.11,45.34 | v13.97,45.09 R11.2
  Bottom 0.254: v23.11,45.34 14.22,45.34 v13.97,45.09
N$1
  Top 0.254: U3.13 22.86,50.04 XTAL1.3 22.39,49.5 21.48,48.59 20.1,48.59 19.14,49.55 C5.2
N$3
  Top 0.254: U3.12 23.59,51.31 23.08,50.79 21.57,50.79 20.79,51.58 XTAL1.1 20.75,51.82 C2.2
N$4
  Top 0.254: R10.1 46.32,22.91 D1.ANODE
N$7
  Top 0.254: U1.4 30.8,8.41 R8.2 29.17,8.26 R7.1
N$9
  Top 0.406: L1.2 36.45,12.78 U1.1
POWER_SW  (via drill 0.25)
  Top 0.254: v17.27,15.88 16.56,15.88 16.24,16.2 Q4.1 | U3.3 32.9,43.69 32.64,43.42 32.64,40.64 36.7,36.58 v36.7,17.02
  Bottom 0.254: v17.27,15.88 24.16,15.88 24.18,15.86 35.55,15.86 v36.7,17.02
RX
  Top 0.254: U3.2 36.58,42.42 38.77,44.62 S1.6
SCL  (via drill 0.25)
  Top 0.254: U3.16 26.29,46.23 26.67,45.85 v26.67,44.96 26.7,44.93 32.37,44.93 32.98,45.54 35.63,45.54 37.49,47.4 37.49,47.98 38.15,48.64 42.93,48.64 43.77,47.79 S1.4
  Bottom 0.254: v26.67,44.96 26.16,44.45 12.04,44.45 10.95,45.55 10.95,48.67 ISP1.3
SCL_OB
  Top 0.2: U6.7 10.21,37.03 13.13,34.11 J1.4
  Top 0.254: J1.4 16.67,35.15 16.67,39.62 15.22,41.07 15.22,43.71 15.54,44.03 R1.1 16.51,46.58 17.2,47.27 22.97,47.27 23.77,48.08 26.22,48.08 26.8,47.5 U3.6
SCL_OB_LV  (via drill 0.25)
  Top 0.2: U4.4 4.07,33.01 v4.19,32.89 | U6.2 7.12,37.03 7.07,37.08 6.6,37.08 v6.1,36.58
  Bottom 0.2: v4.19,32.89 4.19,33.45 3.69,33.95 3.69,34.5 5.76,36.58 v6.1,36.58
SDA  (via drill 0.25)
  Top 0.254: U3.20 v26.64,41.15 29.72,41.15 32.89,44.32 35.69,44.32 37.9,46.53 37.9,47.81 38.22,48.13 42.04,48.13 42.55,47.62 42.55,43.81 43.77,42.59 S1.3
  Bottom 0.254: v26.64,41.15 27.3,41.81 27.3,46.1 26.8,46.61 17.56,46.61 17.18,46.23 14.33,46.23 13.51,47.05 13.51,48.69 ISP1.4
SDA_OB
  Top 0.2: U6.6 9.47,36.63 14.53,31.57 J1.3
  Top 0.254: J1.3 17.07,33.02 17.07,39.79 15.73,41.13 15.73,42.95 15.89,43.11 17.2,43.11 18.12,44.03 R2.1 19.05,44.96 19.56,45.47 22.35,45.47 23.75,46.86 35.69,46.86 36.07,47.24 36.07,48.39 35.69,48.77 U3.7
SDA_OB_LV  (via drill 0.25)
  Top 0.2: U4.6 3.16,34.16 v4.19,34.16 | U6.3 6.91,36.63 v6.86,36.58
  Bottom 0.2: v4.19,34.16 4.45,34.16 v6.86,36.58
SIG1  (via drill 0.25)
  Top 0.254: Q2.3 25.74,22.77 | 25.74,22.77 24.97,22.01 R6.1 | 25.74,22.77 25.74,24.85 26.92,26.04 26.92,28.19 30.61,31.88 v31.75,31.88 | v41.27,42.93 S1.2
  Bottom 0.254: v41.27,42.93 39.13,42.93 32.28,36.08 32.28,32.41 v31.75,31.88
SIG1_LV
  Top 0.254: Q2.2 29.62,23.81 R3.1 32.22,23.71 33.12,24.61 J2.3
SIG2  (via drill 0.25)
  Top 0.254: Q1.3 25.82,27.56 | 25.82,27.56 25.82,28.11 30.73,33.02 v31.75,33.02 | R5.1 24.17,27.56 25.82,27.56 | v41.27,44.58 S1.5
  Bottom 0.254: v31.75,33.02 31.75,36.83 39.5,44.58 v41.27,44.58
SIG2_LV
  Top 0.254: J2.4 32.66,27.15 32.38,27.43 29.76,27.43 R4.1 29.49,27.62 Q1.2
STAT_LED  (via drill 0.25)
  Top 0.254: v31.37,43.56 25.12,43.56 U3.18 | v42.8,24.77 R10.2
  Bottom 0.254: v31.37,43.56 31.22,43.4 31.22,31.66 31.53,31.34 32.55,31.34 39.13,24.77 v42.8,24.77
SWITCH_OUT
  Top 0.2: U2.2 37.48,52.47 36.32,51.31 U3.9
TX
  Top 0.254: U3.1 38.56,41.15 S1.1
VIN+  (via drill 0.25)
  Top 0.2: v34.42,8.26 C3.1 | Q3.1 30.52,17.65 35.68,17.65
  Top 0.254: U1.3 30.32,12.78 v29.98,12.45 | J2.2 34.5,22.01 R3.2 28.02,22.01 Q2.1 27.24,21.91 26.92,22.23 26.92,25.4 27.24,25.72 Q1.1 27.95,25.69 R4.2
  Top 0.406: C3.1 36.09,9.72 L1.1 | U1.6 33.06,9.72 C3.1 | C3.1 35.5,8.64 38.61,8.64 39.5,9.53 39.5,12.19 35.68,16.01 35.68,17.65 35.68,20 34.56,21.11 J2.2
  Bottom 0.254: v29.98,12.45 29.98,7.61 30.23,7.37 34.04,7.37 34.42,7.75 v34.42,8.26
  pour Top (rank 2, no thermals): 32.38,10.79 32.38,9.53 33.15,9.53 34.04,8.64 34.04,8 34.29,7.75 37.85,7.75 37.85,10.92 35.56,10.92 35.05,10.41 33.4,10.41 33.02,10.79
VIN-
  Top 0.61: J2.1 34.52,19.49 Q3.2

### Text on the board
tDocu: UART | I2C | Yellow | MODE | Orange | EN | SCL | Green | SDA | 5V_SW | Blue | GND | Red | Black | To LiDAR | RX/SCL / TX/SDA / Vin / GND | From / Logger | LiDAR Lite Interface
bDocu: Project-Symbiont-LiDAR / v0.0.0 / 07-12-2019 / / Bobby Schulz / / Northern Widget LLC / and University of Minnesota